# Altium schematic sheet power.SCHDOC: 8+2 Acquisition Board
size B; Engineer: Eric Jonas (jonas@mwl.mit.edu); Organization: PILM, MIT; Address1: 46-5227; Address2: 43 Vassar St.; Address3: Cambridge, MA 02139; Address4: Australia 2086
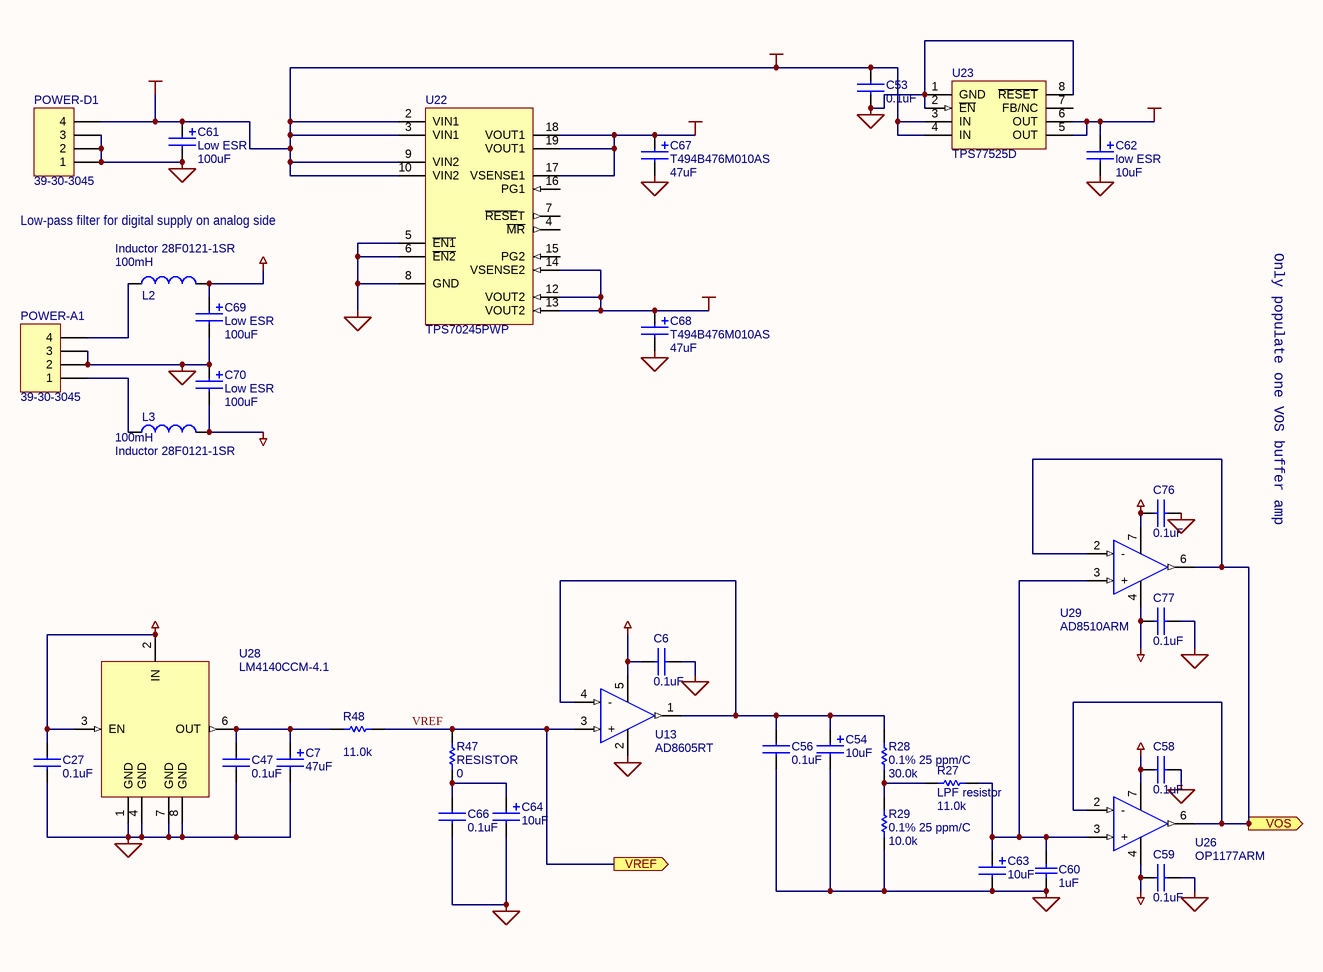
[diagram p0: power.SCHDOC]

## Parts
C6  value 0.1uF  [0603]  (hidden comment: CAPACITOR)
C7  value 47uF  [3528]  (hidden comment: POLCAP)
C27  value 0.1uF  [0603]  (hidden comment: CAPACITOR)
C47  value 0.1uF  [0603]  (hidden comment: CAPACITOR)
C53  value 0.1uF  [0603]  (hidden comment: CAPACITOR)
C54  value 10uF  [3216]  (hidden comment: Tantalum)
C56  value 0.1uF  [0603]  (hidden comment: CAPACITOR)
C58  value 0.1uF  [0603]  (hidden comment: CAPACITOR)
C59  value 0.1uF  [0603]  (hidden comment: CAPACITOR)
C60  value 1uF  [CC1608-0603]  (hidden comment: Cap)
C61  Low ESR  value 100uF  [PanasonicE]
C62  low ESR  value 10uF  [3216]
C63  value 10uF  [3216]  (hidden comment: Tantalum)
C64  value 10uF  [3216]  (hidden comment: Tantalum)
C66  value 0.1uF  [0603]  (hidden comment: CAPACITOR)
C67  T494B476M010AS  value 47uF  [3528]
C68  T494B476M010AS  value 47uF  [3528]
C69  Low ESR  value 100uF  [PanasonicE]
C70  Low ESR  value 100uF  [PanasonicE]
C76  value 0.1uF  [0603]  (hidden comment: CAPACITOR)
C77  value 0.1uF  [0603]  (hidden comment: CAPACITOR)
L2  Inductor 28F0121-1SR  value 100mH  [STEWARD_1SR]
L3  Inductor 28F0121-1SR  value 100mH  [STEWARD_1SR]
POWER-A1  39-30-3045  [MJ4RTHR]
POWER-D1  39-30-3045  [MJ4RTHR]
R27  LPF resistor  value 11.0k  [0603]
R28  0.1% 25 ppm/C  value 30.0k  [0603]
R29  0.1% 25 ppm/C  value 10.0k  [0603]
R47  RESISTOR  value 0  [0603]
R48  value 11.0k  [0603]  (hidden comment: RESISTOR)
U13  AD8605RT  [SOT-5]
U22  TPS70245PWP  [PWP PowerPad -20]
U23  TPS77525D  [SO-G8]
U26  OP1177ARM  [TSSO3X5-G8/X.4]
U28  LM4140CCM-4.1  [SO-G8/D5]
U29  AD8510ARM  [TSSO3X5-G8/X.4]

## Ports
VOS (out), VREF (out)

## Nets
+1.2VCC: C68.1 U22.12(VOUT2) U22.13(VOUT2) U22.14(VSENSE2)
+2.5VCC: C62.1 U23.5(OUT) U23.6(OUT)
+5VCC: C53.1 C61.1 POWER-D1.4 U22.2(VIN1) U22.3(VIN1) U22.9(VIN2) U22.10(VIN2) U23.3(IN) U23.4(IN)
AGND: C6.2 C7.2 C27.2 C47.2 C54.2 C56.2 C58.1 C59.1 C60.2 C63.2 C64.2 C66.2 C69.2 C70.1 C76.2 C77.2 POWER-A1.2 POWER-A1.3 R29.1 U13.2(-Vs) U28.1(GND) U28.4(GND) U28.7(GND) U28.8(GND)
AVDD: C6.1 C27.1 C58.2 C69.1 C76.1 L2.2 U13.5(+Vs) U26.7(+Vs) U28.2(IN) U28.3(EN) U29.7(+Vs)
AVSS: C59.2 C70.2 C77.1 L3.2 U26.4(-Vs) U29.4(-Vs)
GND: C53.2 C61.2 C62.2 C67.2 C68.2 POWER-D1.1 POWER-D1.2 POWER-D1.3 U22.5(~{EN1}) U22.6(~{EN2}) U22.8(GND) U22.P1 U23.1(GND) U23.2(~{EN}) U23.8(~{RESET})
VCC: C67.1 U22.17(VSENSE1) U22.18(VOUT1) U22.19(VOUT1)
VOS: U26.2(-) U26.6(Out) U29.2(-) U29.6(Out) ; port VOS
VREF: R47.2 R48.1 U13.3(+) ; port VREF
NetC7_1: C7.1 C47.1 R48.2 U28.6(OUT)
NetC54_1: C54.1 C56.1 R28.2 U13.1(Out) U13.4(-)
NetC60_1: C60.1 C63.1 R27.1 U26.3(+) U29.3(+)
NetC64_1: C64.1 C66.1 R47.1
NetL2_1: L2.1 POWER-A1.4
NetL3_1: L3.1 POWER-A1.1
NetR27_2: R27.2 R28.1 R29.2

Not connected (* = marked no-connect by the designer): U22 4(~{MR}) 7(~{RESE}T) 15(PG2) 16(PG1); U23 7(FB/NC)

## Notes on the sheet
- Low-pass filter for digital supply on analog side
- Only populate one VOS buffer amp
- Title:
- Engineer:
- Date:
- Revision:
- Sheet
- of
- File:

## Library data of the parts
C6 C27 C47 C53 C56 C58 C59 C66 C76 C77 = CAPACITOR: Standard Capacitor
C7 C54 C61-C64 C67-C70 = POLCAP: Standard Capacitor
  C54 C63 C64: Type: Tantalum
C60 = Cap: Capacitor; Manufacturer: Generic Components; Class I: Passive; Published: 8-Jun-2000; Revision: July-2002: Re-released for DXP Platform.; Publisher: Altium Limited; Class II: Capacitor
L2 L3 = Inductor: Manufacturer: Generic Components; Class I: Passive; Published: 8-Jun-2000; Revision: July-2002: Re-released for DXP Platform.; Publisher: Altium Limited; Class II: Inductor
POWER-A1 POWER-D1 = Header 4: Header, 4-Pin; Manufacturer: Generic Components; Class I: Connector; Revision: July-2002: Re-released for DXP Platform.; Publisher: Altium Limited
R27-R29 R47 R48 = RESISTOR: Standard Passive Resistor
U13 = AD8605RT: Analog Devices Precision Low Noise CMOS Rail-to-Rail Input/Output Operational Amplifier
U22 = TPS70245PWP: TI dual-output low dropout voltage regulators; Vendor: Texas Instruments
U23 = TPS77525D: Fast-transient-response 500 mA low-dropout voltage regulator; Vendor: Texas Instruments
U26 U29 = OP1177: Precision Low Noise, Low Input Bias Current Operational Amplifier; Vendor: Analog Devices
  U26: Part: OP1177ARM
U28 = LM4140CCM: 4.096V Low-noise Voltage Reference; Part: LM4140CCM-4.1